# Altium schematic sheet [5] ADC_CURRENT_PUMP.SchDoc: ADC Current pump
size 393 x 281 mm; SheetNumber: 5; SheetTotal: 21; PageSetup: Record=PageOptions|CenterHorizontal=True|CenterVertical=True|PrintScale=0.94|XCorrection=0.00|YCorrection=0.00|PrintKind=0|BorderSize=5000000|LeftOffset=0|BottomOffset=0|Orientation=2|PaperLength=1000|PaperWidth=1000|Scale=100|PaperSource=15|PrintQuality=600|MediaType=1|DitherType=10|PrintScaleMode=1|PaperKind=A4; Adr1: August Barks gata 6B; Adr2: SE-421 32 Västra Frölunda; Adr3: Sweden; Webpage: www.omnisys.se
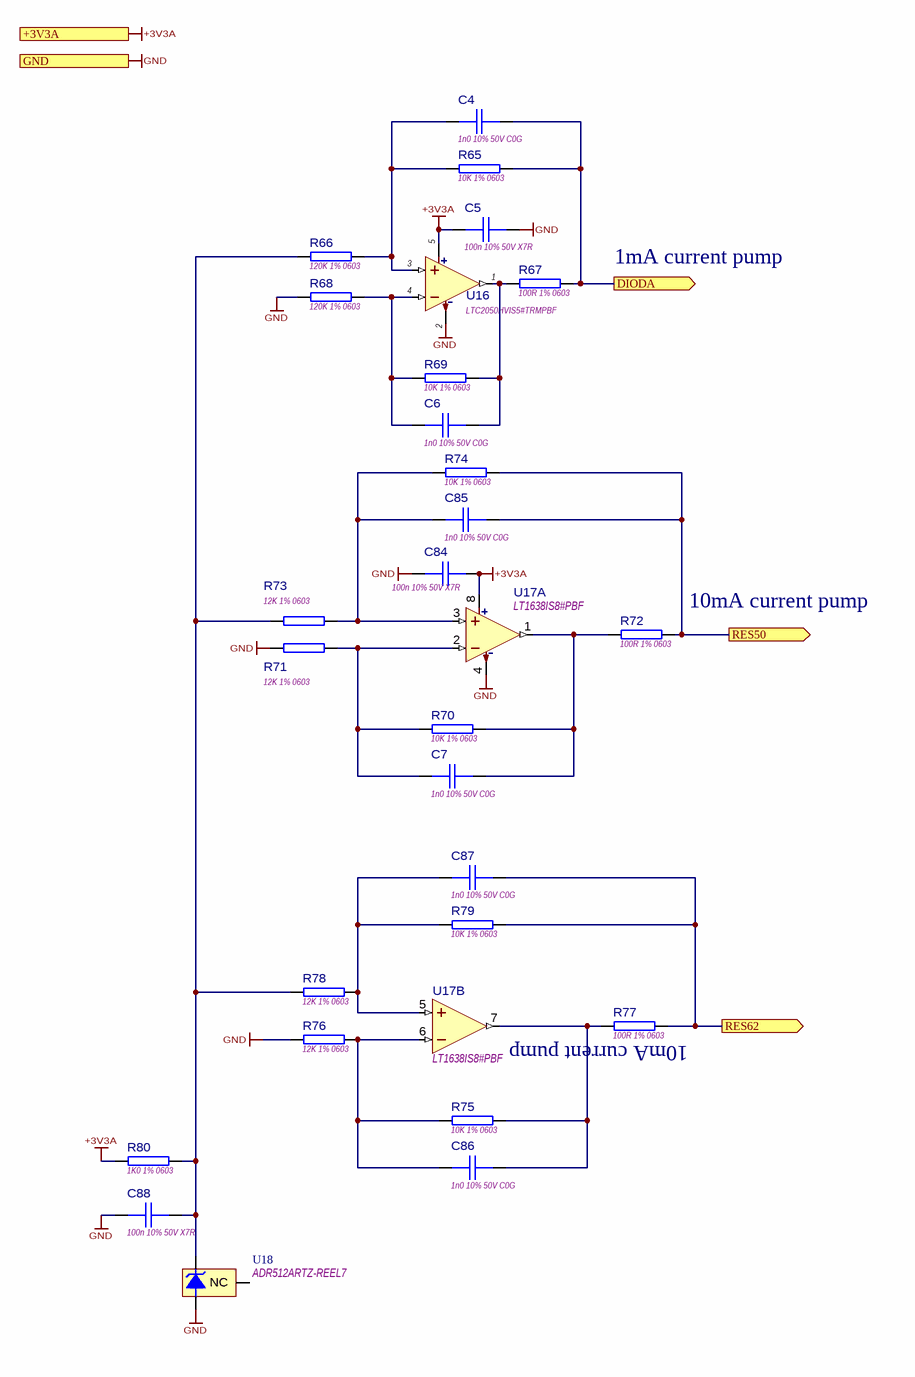
[diagram p0: [5] ADC_CURRENT_PUMP.SchDoc]

## Parts
C4  1n0 10% 50V C0G  [CAPC1608X90N]
C5  100n 10% 50V X7R  [CAPC1608X90N]
C6  1n0 10% 50V C0G  [CAPC1608X90N]
C7  1n0 10% 50V C0G  [CAPC1608X90N]
C84  100n 10% 50V X7R  [CAPC1608X90N]
C85  1n0 10% 50V C0G  [CAPC1608X90N]
C86  1n0 10% 50V C0G  [CAPC1608X90N]
C87  1n0 10% 50V C0G  [CAPC1608X90N]
C88  100n 10% 50V X7R  [CAPC1608X90N]
R65  10K 1% 0603  [RESC1608N]
R66  120K 1% 0603  [RESC1608N]
R67  100R 1% 0603  [RESC1608N]
R68  120K 1% 0603  [RESC1608N]
R69  10K 1% 0603  [RESC1608N]
R70  10K 1% 0603  [RESC1608N]
R71  12K 1% 0603  [RESC1608N]
R72  100R 1% 0603  [RESC1608N]
R73  12K 1% 0603  [RESC1608N]
R74  10K 1% 0603  [RESC1608N]
R75  10K 1% 0603  [RESC1608N]
R76  12K 1% 0603  [RESC1608N]
R77  100R 1% 0603  [RESC1608N]
R78  12K 1% 0603  [RESC1608N]
R79  10K 1% 0603  [RESC1608N]
R80  1K0 1% 0603  [RESC1608N]
U16  LTC2050HVIS5#TRMPBF  [SOT95P280X100-5N]
U17  LT1638IS8#PBF  [SOIC127P600X175-8N]  (parts A,B of 2)
U18  ADR512ARTZ-REEL7  [SOT95P230X110-3N]

## Ports
+3V3A, DIODA (out), GND, RES50 (out), RES62 (out)

## Nets
+3V3A: C5.2 C84.2 R80.2 U16.5(+V) U17.8(+V) ; port +3V3A
GND: C5.1 C84.1 C88.1 R68.1 R71.1 R76.1 U16.2(-V) U17.4(-V) U18.2(-V) ; port GND
DIODA: C4.1 R65.2 R67.1 ; port DIODA
RES50: C85.1 R72.1 R74.2 ; port RES50
RES62: C87.1 R77.1 R79.1 ; port RES62
NetC4_2: C4.2 R65.1 R66.2 U16.3(+IN)
NetC6_1: C6.1 R67.2 R69.2 U16.1(OUT)
NetC6_2: C6.2 R68.2 R69.1 U16.4(-IN)
NetC7_1: C7.1 R70.1 R72.2 U17.1(OutA)
NetC7_2: C7.2 R70.2 R71.2 U17.2(-InA)
NetC85_2: C85.2 R73.2 R74.1 U17.3(+InA)
NetC86_1: C86.1 R75.1 R77.2 U17.7(OutB)
NetC86_2: C86.2 R75.2 R76.2 U17.6(-InB)
NetC87_2: C87.2 R78.2 R79.2 U17.5(+InB)
NetC88_2: C88.2 R66.1 R73.1 R78.1 R80.1 U18.1(+V)

Not connected (* = marked no-connect by the designer): U18 3(NC)

## Notes on the sheet
- 1mA current pump
- (near R72) 10mA current pump
- (near R77) 10mA current pump
- Title:
- SVN:
- August Barks gata 6B
- SE-421 32 Västra Frölunda
- Omnisys Instruments AB
- PCB ASY:
- PCB:
- SVN Folder:
- www.omnisys.se
- Page:
- of
- Print date:
- Page size:
- A3
- Information contained in this drawing is confidential. Copying, distributing or use in any matter, other than that specified by OMNISYS INSTRUMENTS AB, is strictly prohibited.

## Library data of the parts
C4 C6 C7 C85-C87 = CMP-0300-002463-5: Ceramic Chip Capacitor, 0603/1608; Tolerance: 5%; Capacitance: 1nF; Package: 1608/0603; Temperature Charateristics: C0G; Rated Voltage: 50V; Thickness: 900µm; Weight: 9mg
C5 C84 C88 = CMP-0300-002665-6: Ceramic Chip Capacitor, 0603/1608; Capacitance: 100nF; Package: 1608/0603; Temperature Charateristics: X7R; Tolerance: 10%; Rated Voltage: 50V; Thickness: 900µm; Weight: 9mg
R65 R69 R70 R74 R75 R79 = CMP-1800-002045-5: Thick film Chip Resistor, 0603/1608; Power: 100mW; Maximum working voltage: 75V; Temp. Coefficent: 0.01%; Value: 10k; Tolerance: 1%; Case/Package: 0603/1608; Composition: Thick film
R66 R68 = CMP-1800-002071-5: Thick film Chip Resistor, 0603/1608; Power: 100mW; Maximum working voltage: 75V; Temp. Coefficent: 0.01%; Value: 120k; Tolerance: 1%; Case/Package: 0603/1608; Composition: Thick film
R67 R72 R77 = CMP-1800-001998-5: Thick film Chip Resistor, 0603/1608; Value: 100; Power: 100mW; Maximum working voltage: 75V; Temp. Coefficent: 0.01%; Tolerance: 1%; Case/Package: 0603/1608; Composition: Thick film
R71 R73 R76 R78 = CMP-1800-002047-5: Thick film Chip Resistor, 0603/1608; Power: 100mW; Maximum working voltage: 75V; Temp. Coefficent: 0.01%; Value: 12k; Tolerance: 1%; Case/Package: 0603/1608; Composition: Thick film
R80 = CMP-1800-002021-5: Thick film Chip Resistor, 0603/1608; Maximum working voltage: 75V; Temp. Coefficent: 0.01%; Value: 1k; Power: 100mW; Tolerance: 1%; Case/Package: 0603/1608; Composition: Thick film
U16 = CMP-2100-000593-1: Zero-Drift Operational Amplifiers in SOT-23; Common Mode Rejection Ratio: 120dB; Gain Bandwidth Product: 3MHz; Input Bias Current: 25pA; Input Offset Voltage (Vos): 0.5uV; Max Dual Supply Voltage: 5.5V; Max Frequency: 7.5kHz; Max Supply Voltage: 11V; Min Dual Supply Voltage: 1.35V; Min Supply Voltage: 2.7V; Number of Channels: 1; Operating Supply Current: 1mA; Slew Rate: 2V/µs; Voltage Gain: 140dB; Case/Package: SOT-23-5; Height: 0.9mm; Lead Free: Lead Free; Length: 2.9mm; Max Operating Temperature: 85°C; Min Operating Temperature: -40°C; Nominal Gain Bandwidth Product: 3MHz; Number of Circuits: 1; Number of Elements: 1; Number of Pins: 5; Package Quantity: 1; Packaging: Tape and Reel; Power Supply Rejection Ratio (PSRR): 120dB; Unity Gain Bandwidth Product: 3MHz; Width: 1.75mm
U17 = CMP-2100-000588-1: 215MHz, Rail-to-Rail Output, 1.1nV/√Hz, 3.5mA Op Amp; Bandwidth: 1.2MHz; Common Mode Rejection Ratio: 80dB; Dual Supply Voltage: 3V; Input Bias Current: 20nA; Input Offset Voltage (Vos): 600uV; Max Dual Supply Voltage: 22V; Max Supply Current: 460uA; Max Supply Voltage: 44V; Min Dual Supply Voltage: 1.25V; Min Supply Voltage: 2.2V; Number of Amplifiers: 2; Operating Supply Current: 205uA; Output Current per Channel: 40mA; Power Supply Rejection Ratio (PSRR): 90dB; Slew Rate: 0.38V/µs; Unity Gain Bandwidth Product: 1.075MHz; Voltage Gain: 123.52dB; Case/Package: SOIC; Gain Bandwidth Product: 1.2MHz; Height: 1.5mm; Lead Free: Lead Free; Length: 5mm; Max Operating Temperature: 85°C; Min Operating Temperature: -40°C; Nominal Gain Bandwidth Product: 1.2MHz; Number of Channels: 2; Number of Circuits: 2; Number of Elements: 2; Number of Pins: 8; Operating Supply Voltage: 3V; Package Quantity: 100; Packaging: Rail/Tube; REACH SVHC: No SVHC; Width: 3.99mm
U18 = CMP-2100-000594-1: 1.2 V Precision Low Noise Shunt Voltage Reference; Max Output Current: 10mA; Max Output Voltage: 1.2V; Temperature Coefficient: 60ppm/°C; Tolerance: 0.3%; Cathode Current: 100uA; Output Type: Fixed; Case/Package: SOT; Height: 1.02mm; Lead Free: Contains Lead; Length: 3.04mm; Max Operating Temperature: 85°C; Min Operating Temperature: -40°C; Number of Pins: 3; Output Current: 10mA; Output Voltage: 1.2V; Package Quantity: 1; Packaging: Tape and Reel; Radiation Hardening: No; REACH SVHC: No SVHC; Reference Type: Shunt; Reference Voltage: 1.2V; Width: 1.4mm; Min Output Voltage: 1.2V